# Altium project SPW-SPAI-ANODE-002D-SCH-FM.PrjPcb (part 1 of 3)
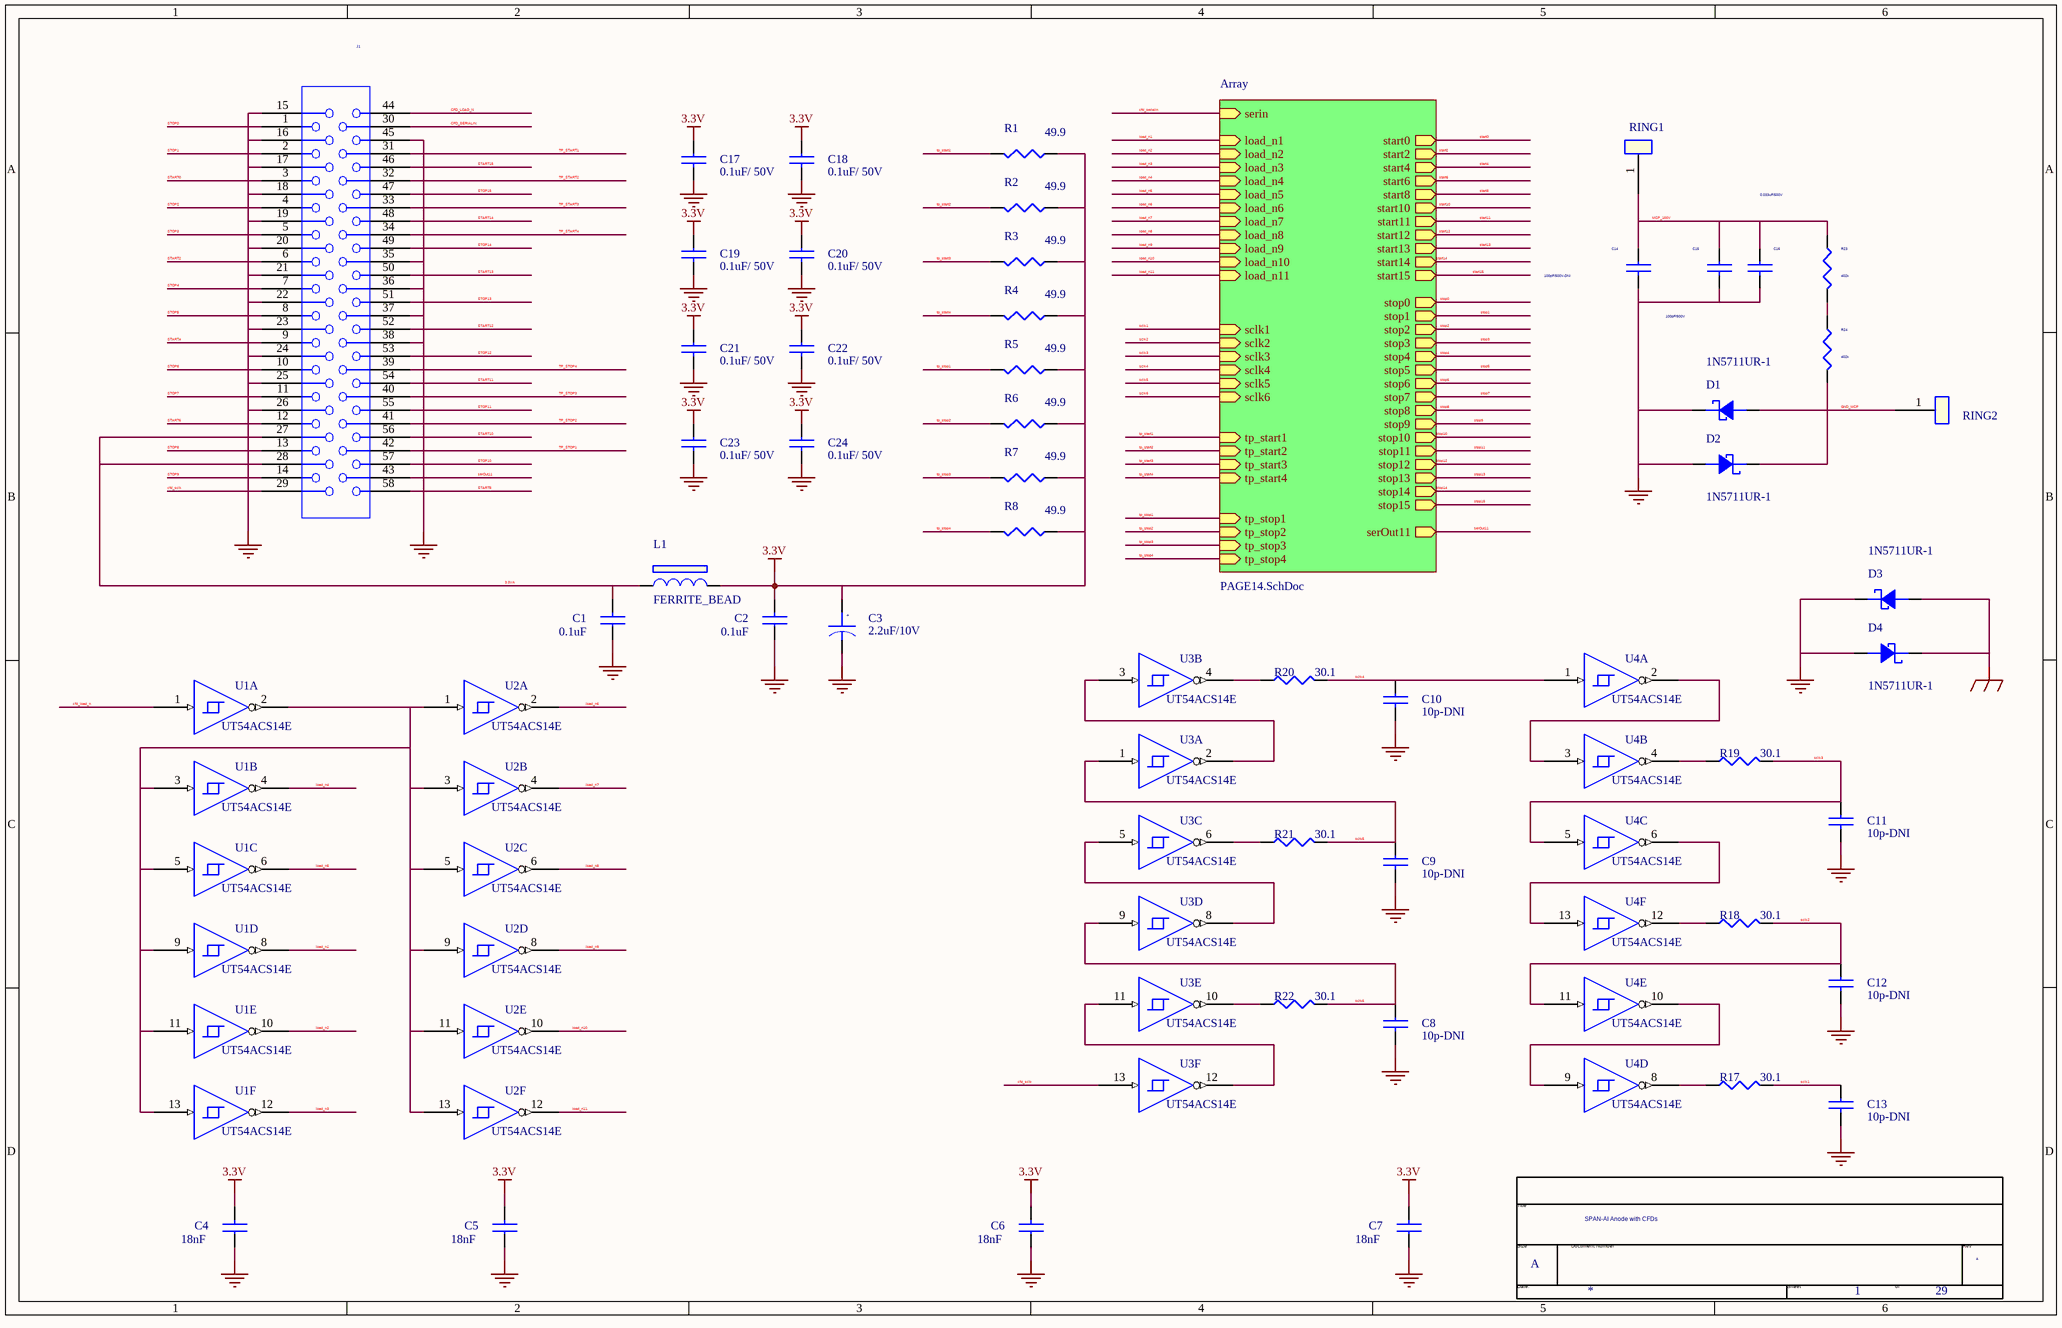
[diagram p0: PAGE1.SchDoc]
5 sheets, 648 parts. Net scope: hierarchical (ports join the sheet entries above them; power ports are global).
Sheets:
  PAGE1.SchDoc
    Array = PAGE14.SchDoc
      CFD17 = PAGE13.SchDoc
      CFD3 = PAGE11.SchDoc
      CFD15 = PAGE13.SchDoc
      CFD13 = PAGE13.SchDoc
      CFD11 = PAGE11.SchDoc
      CFD1 = PAGE11.SchDoc
      CFD9 = PAGE11.SchDoc
      CFD26 = PAGE12.SchDoc
      CFD24 = PAGE12.SchDoc
      CFD7 = PAGE11.SchDoc
      CFD22 = PAGE12.SchDoc
      CFD5 = PAGE11.SchDoc
      CFD20 = PAGE12.SchDoc
      CFD18 = PAGE12.SchDoc
      CFD16 = PAGE12.SchDoc
      CFD14 = PAGE12.SchDoc
      CFD12 = PAGE12.SchDoc
      CFD10 = PAGE11.SchDoc
      CFD2 = PAGE11.SchDoc
      CFD27 = PAGE12.SchDoc
      CFD25 = PAGE12.SchDoc
      CFD8 = PAGE11.SchDoc
      CFD23 = PAGE12.SchDoc
      CFD6 = PAGE11.SchDoc
      CFD21 = PAGE13.SchDoc
      CFD4 = PAGE11.SchDoc
      CFD19 = PAGE13.SchDoc

## Sheet PAGE1.SchDoc
size 386 x 246 mm

### Parts
(Parts that share a designator on the sheet are numbered #1, #2 ... from top to bottom, then left to right.)
*#1  Page Count: 29  Page Number: 1  Page Size: A  Title: SPAN-AI Anode with CFDs  (hidden comment: TitleBlock0)  (graphical)
C1  0.1uF  [1206]
C2  0.1uF  [1206]
C3  2.2uF/10V  [CAP-CWR069-B]
C4  18nF  [0805]
C5  18nF  [0805]
C6  18nF  [0805]
C7  18nF  [0805]
C8  10p-DNI  [0402]
C9  10p-DNI  [0402]
C10  10p-DNI  [0402]
C11  10p-DNI  [0402]
C12  10p-DNI  [0402]
C13  10p-DNI  [0402]
C14  100pF/500V-DNI  [1210MIL]
C15  100pF/500V  [1210MIL]
C16  0.033uF/500V  [1812MIL]
C17  0.1uF/ 50V  [1206]
C18  0.1uF/ 50V  [1206]
C19  0.1uF/ 50V  [1206]
C20  0.1uF/ 50V  [1206]
C21  0.1uF/ 50V  [1206]
C22  0.1uF/ 50V  [1206]
C23  0.1uF/ 50V  [1206]
C24  0.1uF/ 50V  [1206]
D1  1N5711UR-1  [DO-213AA]
D2  1N5711UR-1  [DO-213AA]
D3  1N5711UR-1  [DO-213AA]
D4  1N5711UR-1  [DO-213AA]
J1  CONNECTOR-HDLP-058M  [HDLP058M-SM]  (value not drawn)
L1  FERRITE_BEAD  [bead-300mil]
R1  49.9  [RES2512]
R2  49.9  [RES2512]
R3  49.9  [RES2512]
R4  49.9  [RES2512]
R5  49.9  [RES2512]
R6  49.9  [RES2512]
R7  49.9  [RES2512]
R8  49.9  [RES2512]
R17  30.1  [0402]
R18  30.1  [0402]
R19  30.1  [0402]
R20  30.1  [0402]
R21  30.1  [0402]
R22  30.1  [0402]
R23  402k  [1206MIL]
R24  402k  [1206MIL]
RING1  MCP_100V  [ANODE]  (value not drawn)
RING2  GND_MCP  [ANODE]  (value not drawn)
U1  UT54ACS14E  [UT54ACS14E]  (parts A,B,C,D,E,F of 6)
U2  UT54ACS14E  [UT54ACS14E]  (parts A,B,C,D,E,F of 6)
U3  UT54ACS14E  [UT54ACS14E]  (parts A,B,C,D,E,F of 6)
U4  UT54ACS14E  [UT54ACS14E]  (parts A,B,C,D,E,F of 6)

### Sub-sheets
Array = PAGE14.SchDoc: stop10 (out), stop5 (out), stop11 (out), stop6 (out), stop12 (out), stop7 (out), start2 (out), stop13 (out), stop8 (out), stop14 (out), stop9 (out), start4 (out), stop15 (out), start6 (out), start8 (out), start10 (out), start11 (out), stop1 (out), stop2 (out), stop3 (out), stop4 (out), load_n6 (in), sclk3 (in), load_n7 (in), sclk4 (in), load_n8 (in), sclk5 (in), sclk6 (in), tp_stop1 (in), tp_stop2 (in), tp_stop3 (in), tp_stop4 (in), tp_start1 (in), tp_start2 (in), tp_start3 (in), tp_start4 (in), load_n1 (in), load_n2 (in), load_n3 (in), load_n4 (in), sclk1 (in), load_n5 (in), sclk2 (in), serin (in), serOut11 (out), load_n9 (in), load_n10 (in), load_n11 (in), start0 (out), stop0 (out), start12 (out), start13 (out), start14 (out), start15 (out)  | CFD13_R105_PartReference: R1305; CFD13_R104_PartReference: R1304; CFD13_D1301_PartReference: D1301; CFD13_R1307_PartReference: R1307; CFD13_DL101_PartReference: DL1301; CFD13_C104_PartReference: C1304; CFD13_R108_PartReference: R108; CFD13_C102_PartReference: C1302; CFD13_R102_PartReference: R1302; CFD13_R101_PartReference: R1301; CFD13_R103_PartReference: R1303; CFD13_C105_PartReference: C1305; CFD13_U101_PartReference: U1301; CFD13_C101_PartReference: C1301; CFD13_C107_PartReference: C107; CFD13_R106_PartReference: R1306; CFD13_C106_PartReference: C1306; CFD13_C100_PartReference: C1300; CFD13_R1309_PartReference: R1309; CFD13_C103_PartReference: C1303; CFD13_TitleBlock_2_Page_Number: 17; CFD14_R1204_PartReference: R1404; CFD14_D1201_PartReference: D1401; CFD14_R1205_PartReference: R1405; CFD14_C1200_PartReference: C1400; CFD14_R1206_PartReference: R1406; CFD14_R108_PartReference: R1408; CFD14_U1201_PartReference: U1401; CFD14_R1202_PartReference: R1402; CFD14_R1207_PartReference: R1407; CFD14_C1204_PartReference: C1404; CFD14_R1203_PartReference: R1403; CFD14_C1201_PartReference: C1401; CFD14_C1206_PartReference: C1406; CFD14_C1207_PartReference: C1407; CFD14_C1205_PartReference: C1405; CFD14_DL1201_PartReference: DL1401; CFD14_R1201_PartReference: R1401; CFD14_R1209_PartReference: R1409; CFD14_C1203_PartReference: C1403; CFD14_C1202_PartReference: C1402; CFD14_TitleBlock_1_Page_Number: 27; CFD15_R105_PartReference: R1505; CFD15_R104_PartReference: R1504; CFD15_D1301_PartReference: D1501; CFD15_R1307_PartReference: R1507; CFD15_DL101_PartReference: DL1501; CFD15_C104_PartReference: C1504; CFD15_R108_PartReference: R1508; CFD15_C102_PartReference: C1502; CFD15_R102_PartReference: R1502; CFD15_R101_PartReference: R1501; CFD15_R103_PartReference: R1503; CFD15_C105_PartReference: C1505; CFD15_U101_PartReference: U1501; CFD15_C101_PartReference: C1501; CFD15_C107_PartReference: C1507; CFD15_R106_PartReference: R1506; CFD15_C106_PartReference: C1506; CFD15_C100_PartReference: C1500; CFD15_R1309_PartReference: R1509; CFD15_C103_PartReference: C1503; CFD15_TitleBlock_2_Page_Number: 6; CFD16_R1204_PartReference: R1604; CFD16_D1201_PartReference: D1601; CFD16_R1205_PartReference: R1605; CFD16_C1200_PartReference: C1600; CFD16_R1206_PartReference: R1606; CFD16_R108_PartReference: R1608; CFD16_U1201_PartReference: U1601; CFD16_R1202_PartReference: R1602; CFD16_R1207_PartReference: R1607; CFD16_C1204_PartReference: C1604; CFD16_R1203_PartReference: R1603; CFD16_C1201_PartReference: C1601; CFD16_C1206_PartReference: C1606; CFD16_C1207_PartReference: C1607; CFD16_C1205_PartReference: C1605; CFD16_DL1201_PartReference: DL1601; CFD16_R1201_PartReference: R1601; CFD16_R1209_PartReference: R1609; CFD16_C1203_PartReference: C1603; CFD16_C1202_PartReference: C1602; CFD16_TitleBlock_1_Page_Number: 14; CFD17_R105_PartReference: R1705; CFD17_R104_PartReference: R1704; CFD17_D1301_PartReference: D1701; CFD17_R1307_PartReference: R1707; CFD17_DL101_PartReference: DL1701; CFD17_C104_PartReference: C1704; CFD17_R108_PartReference: R1708; CFD17_C102_PartReference: C1702; CFD17_R102_PartReference: R1702; CFD17_R101_PartReference: R1701; CFD17_R103_PartReference: R1703; CFD17_C105_PartReference: C1705; CFD17_U101_PartReference: U1701; CFD17_C101_PartReference: C1701; CFD17_C107_PartReference: C1707; CFD17_R106_PartReference: R1706; CFD17_C106_PartReference: C1706; CFD17_C100_PartReference: C1700; CFD17_R1309_PartReference: R1709; CFD17_C103_PartReference: C1703; CFD17_TitleBlock_2_Page_Number: 3; CFD18_R1204_PartReference: R1804; CFD18_D1201_PartReference: D1801; CFD18_R1205_PartReference: R1805; CFD18_C1200_PartReference: C1800; CFD18_R1206_PartReference: R1806; CFD18_R108_PartReference: R1808; CFD18_U1201_PartReference: U1801; CFD18_R1202_PartReference: R1802; CFD18_R1207_PartReference: R1807; CFD18_C1204_PartReference: C1804; CFD18_R1203_PartReference: R1803; CFD18_C1201_PartReference: C1801; CFD18_C1206_PartReference: C1806; CFD18_C1207_PartReference: C1807; CFD18_C1205_PartReference: C1805; CFD18_DL1201_PartReference: DL1801; CFD18_R1201_PartReference: R1801; CFD18_R1209_PartReference: R1809; CFD18_C1203_PartReference: C1803; CFD18_C1202_PartReference: C1802; CFD18_TitleBlock_1_Page_Number: 13; CFD19_R105_PartReference: R1905; CFD19_R104_PartReference: R1904; CFD19_D1301_PartReference: D1901; CFD19_R1307_PartReference: R1907; CFD19_DL101_PartReference: DL1901; CFD19_C104_PartReference: C1904; CFD19_R108_PartReference: R1908; CFD19_C102_PartReference: C1902; CFD19_R102_PartReference: R1902; CFD19_R101_PartReference: R1901; CFD19_R103_PartReference: R1903; CFD19_C105_PartReference: C1905; CFD19_U101_PartReference: U1901; CFD19_C101_PartReference: C1901; CFD19_C107_PartReference: C1907; CFD19_R106_PartReference: R1906; CFD19_C106_PartReference: C1906; CFD19_C100_PartReference: C1900; CFD19_R1309_PartReference: R1909; CFD19_C103_PartReference: C1903; CFD19_TitleBlock_2_Page_Number: 15; CFD20_R1204_PartReference: R2004; CFD20_D1201_PartReference: D2001; CFD20_R1205_PartReference: R2005; CFD20_C1200_PartReference: C2000; CFD20_R1206_PartReference: R2006; CFD20_R108_PartReference: R2008; CFD20_U1201_PartReference: U2001; CFD20_R1202_PartReference: R2002; CFD20_R1207_PartReference: R2007; CFD20_C1204_PartReference: C2004; CFD20_R1203_PartReference: R2003; CFD20_C1201_PartReference: C2001; CFD20_C1206_PartReference: C2006; CFD20_C1207_PartReference: C2007; CFD20_C1205_PartReference: C2005; CFD20_DL1201_PartReference: DL2001; CFD20_R1201_PartReference: R2001; CFD20_R1209_PartReference: R2009; CFD20_C1203_PartReference: C2003; CFD20_C1202_PartReference: C2002; CFD20_TitleBlock_1_Page_Number: 24; CFD21_R105_PartReference: R2105; CFD21_R104_PartReference: R2104; CFD21_D1301_PartReference: D2101; CFD21_R1307_PartReference: R2107; CFD21_DL101_PartReference: DL2101; CFD21_C104_PartReference: C2104; CFD21_R108_PartReference: R2108; CFD21_C102_PartReference: C2102; CFD21_R102_PartReference: R2102; CFD21_R101_PartReference: R2101; CFD21_R103_PartReference: R2103; CFD21_C105_PartReference: C2105; CFD21_U101_PartReference: U2101; CFD21_C101_PartReference: C2101; CFD21_C107_PartReference: C2107; CFD21_R106_PartReference: R2106; CFD21_C106_PartReference: C2106; CFD21_C100_PartReference: C2100; CFD21_R1309_PartReference: R2109; CFD21_C103_PartReference: C2103; CFD21_TitleBlock_2_Page_Number: 22; CFD22_R1204_PartReference: R2204; CFD22_D1201_PartReference: D2201; CFD22_R1205_PartReference: R2205; CFD22_C1200_PartReference: C2200; CFD22_R1206_PartReference: R2206; CFD22_R108_PartReference: R2208; CFD22_U1201_PartReference: U2201; CFD22_R1202_PartReference: R2202; CFD22_R1207_PartReference: R2207; CFD22_C1204_PartReference: C2204; CFD22_R1203_PartReference: R2203; CFD22_C1201_PartReference: C2201; CFD22_C1206_PartReference: C2206; CFD22_C1207_PartReference: C2207; CFD22_C1205_PartReference: C2205; CFD22_DL1201_PartReference: DL2201; CFD22_R1201_PartReference: R2201; CFD22_R1209_PartReference: R2209; CFD22_C1203_PartReference: C2203; CFD22_C1202_PartReference: C2202; CFD22_TitleBlock_1_Page_Number: 19; CFD23_R1204_PartReference: R2304; CFD23_D1201_PartReference: D2301; CFD23_R1205_PartReference: R2305; CFD23_C1200_PartReference: C2300; CFD23_R1206_PartReference: R2306; CFD23_R108_PartReference: R2308; CFD23_U1201_PartReference: U2301; CFD23_R1202_PartReference: R2302; CFD23_R1207_PartReference: R2307; CFD23_C1204_PartReference: C2304; CFD23_R1203_PartReference: R2303; CFD23_C1201_PartReference: C2301; CFD23_C1206_PartReference: C2306; CFD23_C1207_PartReference: C2307; CFD23_C1205_PartReference: C2305; CFD23_DL1201_PartReference: DL2301; CFD23_R1201_PartReference: R2301; CFD23_R1209_PartReference: R2309; CFD23_C1203_PartReference: C2303; CFD23_C1202_PartReference: C2302; CFD23_TitleBlock_1_Page_Number: 20; CFD24_R1204_PartReference: R2404; CFD24_D1201_PartReference: D2401; CFD24_R1205_PartReference: R2405; CFD24_C1200_PartReference: C2400; CFD24_R1206_PartReference: R2406; CFD24_R108_PartReference: R2408; CFD24_U1201_PartReference: U2401; CFD24_R1202_PartReference: R2402; CFD24_R1207_PartReference: R2407; CFD24_C1204_PartReference: C2404; CFD24_R1203_PartReference: R2403; CFD24_C1201_PartReference: C2401; CFD24_C1206_PartReference: C2406; CFD24_C1207_PartReference: C2407; CFD24_C1205_PartReference: C2405; CFD24_DL1201_PartReference: DL2401; CFD24_R1201_PartReference: R2401; CFD24_R1209_PartReference: R2409; CFD24_C1203_PartReference: C2403; CFD24_C1202_PartReference: C2402; CFD24_TitleBlock_1_Page_Number: 26; CFD25_R1204_PartReference: R2504; CFD25_D1201_PartReference: D2501; CFD25_R1205_PartReference: R2505; CFD25_C1200_PartReference: C2500; CFD25_R1206_PartReference: R2506; CFD25_R108_PartReference: R2508; CFD25_U1201_PartReference: U2501; CFD25_R1202_PartReference: R2502; CFD25_R1207_PartReference: R2507; CFD25_C1204_PartReference: C2504; CFD25_R1203_PartReference: R2503; CFD25_C1201_PartReference: C2501; CFD25_C1206_PartReference: C2506; CFD25_C1207_PartReference: C2507; CFD25_C1205_PartReference: C2505; CFD25_DL1201_PartReference: DL2501; CFD25_R1201_PartReference: R2501; CFD25_R1209_PartReference: R2509; CFD25_C1203_PartReference: C2503; CFD25_C1202_PartReference: C2502; CFD25_TitleBlock_1_Page_Number: 11; CFD26_R1204_PartReference: R2604; CFD26_D1201_PartReference: D2601; CFD26_R1205_PartReference: R2605; CFD26_C1200_PartReference: C2600; CFD26_R1206_PartReference: R2606; CFD26_R108_PartReference: R2608; CFD26_U1201_PartReference: U2601; CFD26_R1202_PartReference: R2602; CFD26_R1207_PartReference: R2607; CFD26_C1204_PartReference: C2604; CFD26_R1203_PartReference: R2603; CFD26_C1201_PartReference: C2601; CFD26_C1206_PartReference: C2606; CFD26_C1207_PartReference: C2607; CFD26_C1205_PartReference: C2605; CFD26_DL1201_PartReference: DL2601; CFD26_R1201_PartReference: R2601; CFD26_R1209_PartReference: R2609; CFD26_C1203_PartReference: C2603; CFD26_C1202_PartReference: C2602; CFD26_TitleBlock_1_Page_Number: 9; CFD27_R1204_PartReference: R2704; CFD27_D1201_PartReference: D2701; CFD27_R1205_PartReference: R2705; CFD27_C1200_PartReference: C2700; CFD27_R1206_PartReference: R2706; CFD27_R108_PartReference: R2708; CFD27_U1201_PartReference: U2701; CFD27_R1202_PartReference: R2702; CFD27_R1207_PartReference: R2707; CFD27_C1204_PartReference: C2704; CFD27_R1203_PartReference: R2703; CFD27_C1201_PartReference: C2701; CFD27_C1206_PartReference: C2706; CFD27_C1207_PartReference: C2707; CFD27_C1205_PartReference: C2705; CFD27_DL1201_PartReference: DL2701; CFD27_R1201_PartReference: R2701; CFD27_R1209_PartReference: R2709; CFD27_C1203_PartReference: C2703; CFD27_C1202_PartReference: C2702; CFD27_TitleBlock_1_Page_Number: 5; CFD2_D101_PartReference: D201; CFD2_R107_PartReference: R207; CFD2_R105_PartReference: R205; CFD2_R104_PartReference: R204; CFD2_DL101_PartReference: DL201; CFD2_C104_PartReference: C204; CFD2_R108_PartReference: R208; CFD2_C102_PartReference: C202; CFD2_R109_PartReference: R209; CFD2_R102_PartReference: R202; CFD2_R101_PartReference: R201; CFD2_R103_PartReference: R203; CFD2_C105_PartReference: C205; CFD2_U101_PartReference: U201; CFD2_C101_PartReference: C201; CFD2_C107_PartReference: C207; CFD2_R106_PartReference: R206; CFD2_C106_PartReference: C206; CFD2_C100_PartReference: C200; CFD2_C103_PartReference: C203; CFD2_TitleBlock_2_Page_Number: 25; CFD1_D101_PartReference: D101; CFD1_R107_PartReference: R107; CFD1_R105_PartReference: R105; CFD1_R104_PartReference: R104; CFD1_DL101_PartReference: DL101; CFD1_C104_PartReference: C104; CFD1_R108_PartReference: R108; CFD1_C102_PartReference: C102; CFD1_R109_PartReference: R109; CFD1_R102_PartReference: R102; CFD1_R101_PartReference: R101; CFD1_R103_PartReference: R103; CFD1_C105_PartReference: C105; CFD1_U101_PartReference: U101; CFD1_C101_PartReference: C101; CFD1_C107_PartReference: C107; CFD1_R106_PartReference: R106; CFD1_C106_PartReference: C106; CFD1_C100_PartReference: C100; CFD1_C103_PartReference: C103; CFD1_TitleBlock_2_Page_Number: 12; CFD3_D101_PartReference: D301; CFD3_R107_PartReference: R307; CFD3_R105_PartReference: R305; CFD3_R104_PartReference: R304; CFD3_DL101_PartReference: DL301; CFD3_C104_PartReference: C304; CFD3_R108_PartReference: R308; CFD3_C102_PartReference: C302; CFD3_R109_PartReference: R309; CFD3_R102_PartReference: R302; CFD3_R101_PartReference: R301; CFD3_R103_PartReference: R303; CFD3_C105_PartReference: C305; CFD3_U101_PartReference: U301; CFD3_C101_PartReference: C301; CFD3_C107_PartReference: C307; CFD3_R106_PartReference: R306; CFD3_C106_PartReference: C306; CFD3_C100_PartReference: C300; CFD3_C103_PartReference: C303; CFD3_TitleBlock_2_Page_Number: 16; CFD4_D101_PartReference: D401; CFD4_R107_PartReference: R407; CFD4_R105_PartReference: R405; CFD4_R104_PartReference: R404; CFD4_DL101_PartReference: DL401; CFD4_C104_PartReference: C404; CFD4_R108_PartReference: R408; CFD4_C102_PartReference: C402; CFD4_R109_PartReference: R409; CFD4_R102_PartReference: R402; CFD4_R101_PartReference: R401; CFD4_R103_PartReference: R403; CFD4_C105_PartReference: C405; CFD4_U101_PartReference: U401; CFD4_C101_PartReference: C401; CFD4_C107_PartReference: C407; CFD4_R106_PartReference: R406; CFD4_C106_PartReference: C406; CFD4_C100_PartReference: C400; CFD4_C103_PartReference: C403; CFD4_TitleBlock_2_Page_Number: 23; CFD5_D101_PartReference: D501; CFD5_R107_PartReference: R507; CFD5_R105_PartReference: R505; CFD5_R104_PartReference: R504; CFD5_DL101_PartReference: DL501; CFD5_C104_PartReference: C504; CFD5_R108_PartReference: R508; CFD5_C102_PartReference: C502; CFD5_R109_PartReference: R509; CFD5_R102_PartReference: R502; CFD5_R101_PartReference: R501; CFD5_R103_PartReference: R503; CFD5_C105_PartReference: C505; CFD5_U101_PartReference: U501; CFD5_C101_PartReference: C501; CFD5_C107_PartReference: C507; CFD5_R106_PartReference: R506; CFD5_C106_PartReference: C506; CFD5_C100_PartReference: C500; CFD5_C103_PartReference: C503; CFD5_TitleBlock_2_Page_Number: 10; CFD6_D101_PartReference: D601; CFD6_R107_PartReference: R607; CFD6_R105_PartReference: R605; CFD6_R104_PartReference: R604; CFD6_DL101_PartReference: DL601; CFD6_C104_PartReference: C604; CFD6_R108_PartReference: R608; CFD6_C102_PartReference: C602; CFD6_R109_PartReference: R609; CFD6_R102_PartReference: R602; CFD6_R101_PartReference: R601; CFD6_R103_PartReference: R603; CFD6_C105_PartReference: C605; CFD6_U101_PartReference: U601; CFD6_C101_PartReference: C601; CFD6_C107_PartReference: C607; CFD6_R106_PartReference: R606; CFD6_C106_PartReference: C606; CFD6_C100_PartReference: C600; CFD6_C103_PartReference: C603; CFD6_TitleBlock_2_Page_Number: 21; CFD7_D101_PartReference: D701; CFD7_R107_PartReference: R707; CFD7_R105_PartReference: R705; CFD7_R104_PartReference: R704; CFD7_DL101_PartReference: DL701; CFD7_C104_PartReference: C704; CFD7_R108_PartReference: R708; CFD7_C102_PartReference: C702; CFD7_R109_PartReference: R709; CFD7_R102_PartReference: R702; CFD7_R101_PartReference: R701; CFD7_R103_PartReference: R703; CFD7_C105_PartReference: C705; CFD7_U101_PartReference: U701; CFD7_C101_PartReference: C701; CFD7_C107_PartReference: C707; CFD7_R106_PartReference: R706; CFD7_C106_PartReference: C706; CFD7_C100_PartReference: C700; CFD7_C103_PartReference: C703; CFD7_TitleBlock_2_Page_Number: 18; CFD8_D101_PartReference: D801; CFD8_R107_PartReference: R807; CFD8_R105_PartReference: R805; CFD8_R104_PartReference: R804; CFD8_DL101_PartReference: DL801; CFD8_C104_PartReference: C804; CFD8_R108_PartReference: R808; CFD8_C102_PartReference: C802; CFD8_R109_PartReference: R809; CFD8_R102_PartReference: R802; CFD8_R101_PartReference: R801; CFD8_R103_PartReference: R803; CFD8_C105_PartReference: C805; CFD8_U101_PartReference: U801; CFD8_C101_PartReference: C801; CFD8_C107_PartReference: C807; CFD8_R106_PartReference: R806; CFD8_C106_PartReference: C806; CFD8_C100_PartReference: C800; CFD8_C103_PartReference: C803; CFD8_TitleBlock_2_Page_Number: 28; CFD9_D101_PartReference: D901; CFD9_R107_PartReference: R907; CFD9_R105_PartReference: R905; CFD9_R104_PartReference: R904; CFD9_DL101_PartReference: DL901; CFD9_C104_PartReference: C904; CFD9_R108_PartReference: R908; CFD9_C102_PartReference: C902; CFD9_R109_PartReference: R909; CFD9_R102_PartReference: R902; CFD9_R101_PartReference: R901; CFD9_R103_PartReference: R903; CFD9_C105_PartReference: C905; CFD9_U101_PartReference: U901; CFD9_C101_PartReference: C901; CFD9_C107_PartReference: C907; CFD9_R106_PartReference: R906; CFD9_C106_PartReference: C906; CFD9_C100_PartReference: C900; CFD9_C103_PartReference: C903; CFD9_TitleBlock_2_Page_Number: 4; CFD10_D101_PartReference: D1001; CFD10_R107_PartReference: R1007; CFD10_R105_PartReference: R1005; CFD10_R104_PartReference: R1004; CFD10_DL101_PartReference: DL1001; CFD10_C104_PartReference: C1004; CFD10_R108_PartReference: R1008; CFD10_C102_PartReference: C1002; CFD10_R109_PartReference: R1009; CFD10_R102_PartReference: R1002; CFD10_R101_PartReference: R1001; CFD10_R103_PartReference: R1003; CFD10_C105_PartReference: C1005; CFD10_U101_PartReference: U1001; CFD10_C101_PartReference: C1001; CFD10_C107_PartReference: C1007; CFD10_R106_PartReference: R1006; CFD10_C106_PartReference: C1006; CFD10_C100_PartReference: C1000; CFD10_C103_PartReference: C1003; CFD10_TitleBlock_2_Page_Number: 2; CFD11_D101_PartReference: D1101; CFD11_R107_PartReference: R1107; CFD11_R105_PartReference: R1105; CFD11_R104_PartReference: R1104; CFD11_DL101_PartReference: DL1101; CFD11_C104_PartReference: C1104; CFD11_R108_PartReference: R1108; CFD11_C102_PartReference: C1102; CFD11_R109_PartReference: R1109; CFD11_R102_PartReference: R1102; CFD11_R101_PartReference: R1101; CFD11_R103_PartReference: R1103; CFD11_C105_PartReference: C1105; CFD11_U101_PartReference: U1101; CFD11_C101_PartReference: C1101; CFD11_C107_PartReference: C1107; CFD11_R106_PartReference: R1106; CFD11_C106_PartReference: C1106; CFD11_C100_PartReference: C1100; CFD11_C103_PartReference: C1103; CFD11_TitleBlock_2_Page_Number: 7; CFD12_R1204_PartReference: R1204; CFD12_D1201_PartReference: D1201; CFD12_R1205_PartReference: R1205; CFD12_C1200_PartReference: C1200; CFD12_R1206_PartReference: R1206; CFD12_R108_PartReference: R1208; CFD12_U1201_PartReference: U1201; CFD12_R1202_PartReference: R1202; CFD12_R1207_PartReference: R1207; CFD12_C1204_PartReference: C1204; CFD12_R1203_PartReference: R1203; CFD12_C1201_PartReference: C1201; CFD12_C1206_PartReference: C1206; CFD12_C1207_PartReference: C1207; CFD12_C1205_PartReference: C1205; CFD12_DL1201_PartReference: DL1201; CFD12_R1201_PartReference: R1201; CFD12_R1209_PartReference: R1209; CFD12_C1203_PartReference: C1203; CFD12_C1202_PartReference: C1202; CFD12_TitleBlock_1_Page_Number: 8; TitleBlock_Page_Number: 29

### Nets
3.3V: C2.2 C3.1 C4.2 C5.2 C6.2 C7.2 C17.1 C18.1 C19.1 C20.1 C21.1 C22.1 C23.1 C24.1 L1.2 R1.1 R2.1 R3.1 R4.1 R5.1 R6.1 R7.1 R8.1 U1.14(3.3V) U2.14(3.3V) U3.14(3.3V) U4.14(3.3V)
GND: C1.1 C2.1 C3.2 C4.1 C5.1 C6.1 C7.1 C8.2 C9.2 C10.2 C11.2 C12.2 C13.2 C14.2 C15.2 C16.2 C17.2 C18.2 C19.2 C20.2 C21.2 C22.2 C23.2 C24.2 D1.1(CATHODE) D2.2(ANODE) D3.1(CATHODE) D4.2(ANODE) J1.15 J1.16 J1.17 J1.18 J1.19 J1.20 J1.21 J1.22 J1.23 J1.24 J1.25 J1.26 J1.35 J1.36 J1.37 J1.38 J1.45 U1.7(GND) U2.7(GND) U3.7(GND) U4.7(GND)
GND_EARTH: D3.2(ANODE) D4.1(CATHODE)
3.3VA: C1.2 J1.27 J1.28 L1.1
CFD_LOAD_N: J1.44 U1.1(A)
cfd_sclk: J1.29 U3.13(A)
cfd_serialin: J1.30 ; sheet Array/serin
GND_MCP: D1.2(ANODE) D2.1(CATHODE) R24.2 RING2.1
load_n1: U1.8(Y) ; sheet Array/load_n1
load_n2: U1.10(Y) ; sheet Array/load_n2
load_n3: U1.12(Y) ; sheet Array/load_n3
load_n4: U1.4(Y) ; sheet Array/load_n4
load_n5: U1.6(Y) ; sheet Array/load_n5
load_n6: U2.2(Y) ; sheet Array/load_n6
load_n7: U2.4(Y) ; sheet Array/load_n7
load_n8: U2.6(Y) ; sheet Array/load_n8
load_n9: U2.8(Y) ; sheet Array/load_n9
load_n10: U2.10(Y) ; sheet Array/load_n10
load_n11: U2.12(Y) ; sheet Array/load_n11
MCP_100V: C14.1 C15.1 C16.1 R23.1 RING1.1
sclk1: C13.1 R17.2 ; sheet Array/sclk1
sclk2: C12.1 R18.2 U4.11(A) ; sheet Array/sclk2
sclk3: C11.1 R19.2 U4.5(A) ; sheet Array/sclk3
sclk4: C10.1 R20.2 U4.1(A) ; sheet Array/sclk4
sclk5: C9.1 R21.2 U3.1(A) ; sheet Array/sclk5
sclk6: C8.1 R22.2 U3.9(A) ; sheet Array/sclk6
serOut11: J1.43 ; sheet Array/serOut11
start0: J1.3 ; sheet Array/start0
start2: J1.6 ; sheet Array/start2
start4: J1.9 ; sheet Array/start4
start6: J1.12 ; sheet Array/start6
start8: J1.58 ; sheet Array/start8
start10: J1.56 ; sheet Array/start10
start11: J1.54 ; sheet Array/start11
start12: J1.52 ; sheet Array/start12
start13: J1.50 ; sheet Array/start13
start14: J1.48 ; sheet Array/start14
start15: J1.46 ; sheet Array/start15
stop0: J1.1 ; sheet Array/stop0
stop1: J1.2 ; sheet Array/stop1
stop2: J1.4 ; sheet Array/stop2
stop3: J1.5 ; sheet Array/stop3
stop4: J1.7 ; sheet Array/stop4
stop5: J1.8 ; sheet Array/stop5
stop6: J1.10 ; sheet Array/stop6
stop7: J1.11 ; sheet Array/stop7
stop8: J1.13 ; sheet Array/stop8
stop9: J1.14 ; sheet Array/stop9
stop10: J1.57 ; sheet Array/stop10
stop11: J1.55 ; sheet Array/stop11
stop12: J1.53 ; sheet Array/stop12
stop13: J1.51 ; sheet Array/stop13
stop14: J1.49 ; sheet Array/stop14
stop15: J1.47 ; sheet Array/stop15
tp_start1: J1.31 R1.2 ; sheet Array/tp_start1
tp_start2: J1.32 R2.2 ; sheet Array/tp_start2
tp_start3: J1.33 R3.2 ; sheet Array/tp_start3
tp_start4: J1.34 R4.2 ; sheet Array/tp_start4
tp_stop1: J1.42 R5.2 ; sheet Array/tp_stop1
tp_stop2: J1.41 R6.2 ; sheet Array/tp_stop2
tp_stop3: J1.40 R7.2 ; sheet Array/tp_stop3
tp_stop4: J1.39 R8.2 ; sheet Array/tp_stop4
NetR17_1: R17.1 U4.8(Y)
NetR18_1: R18.1 U4.12(Y)
NetR19_1: R19.1 U4.4(Y)
NetR20_1: R20.1 U3.4(Y)
NetR21_1: R21.1 U3.6(Y)
NetR22_1: R22.1 U3.10(Y)
NetR23_2: R23.2 R24.1
NetU1_2: U1.2(Y) U1.3(A) U1.5(A) U1.9(A) U1.11(A) U1.13(A) U2.1(A) U2.3(A) U2.5(A) U2.9(A) U2.11(A) U2.13(A)
NetU3_2: U3.2(Y) U3.3(A)
NetU3_5: U3.5(A) U3.8(Y)
NetU3_11: U3.11(A) U3.12(Y)
NetU4_2: U4.2(Y) U4.3(A)
NetU4_6: U4.6(Y) U4.13(A)
NetU4_9: U4.9(A) U4.10(Y)

### Notes on the sheet
- (in symbol CAP POL) +
- (in symbol TitleBlock0) Title; Size; Document Number; Rev; Date:; Sheet; of

### Library data of the parts
C1 C2 = CAP NP_Dup2: PartNumber: SR1206X7R104F2NT95#M123; PCB Footprint: 1206
C3 = CAP POL: PartNumber: CWR09FH225; PCB Footprint: CAP-CWR069-B
C4-C7 = CAP NP_Dup2: PartNumber: SR0805X7R183F2NT95#M123; PCB Footprint: 0805
C8-C13 = CAP NP_Dup2: PartNumber: SR0402NPO100F2NT95#M123; PCB Footprint: 0402
C14 C15 = CAP NP_Dup1: Source Part: CAP NP; Pin Numbers Visible: True; Pin Names Visible: False; EDIForiginalOrigin: (pt 0 0); EDIFviewName: NORMAL; Implementation Type: <none>; Desc: 200 V; Graphic: CAP NP; PCB Footprint: 1210MIL
C16 = CAP NP_Dup1: Source Part: CAP NP; PartNumber: SR1812X7R333K6NT9S; Pin Numbers Visible: True; Pin Names Visible: False; EDIForiginalOrigin: (pt 0 0); EDIFviewName: NORMAL; Implementation Type: <none>; Desc: 200 V; Graphic: CAP NP; PCB Footprint: 1812MIL
C17-C24 = CAP NP: PartNumber: G311P829AFN104K2N3; PCB Footprint: 1206
D1-D4 = DIODE SCHOTTKY_0: PartNumber: JANTXV1N5711UR-1; PCB Footprint: DO-213AA
J1 = CONNECTOR-HDLP-058M_2: OriginalSymbolOrigin: (0,0); PCB Footprint: HDLP058M-SM; PartNumber: HDLP058M-SM
L1 = INDUCTOR FERRITE: PCB Footprint: bead-300mil
R1-R8 = R_Dup1: PartNumber: M55342H09B49D9R; PCB Footprint: RES2512
R17-R22 = R_Dup1: PartNumber: M55342H11B30D1R; PCB Footprint: 0402
R23 R24 = R: Pin Numbers Visible: True; Pin Names Visible: False; EDIForiginalOrigin: (pt 0 0); EDIFviewName: NORMAL; Implementation Type: <none>; Desc: 200V / 0.25W; PCB Footprint: 1206MIL; Source Part: R; Graphic: R
RING1 RING2 = TEST POINT: PCB Footprint: ANODE
U1-U4 = 54AC14_0: PCB Footprint: UT54ACS14E; PartNumber: UT54ACS14E
*#1 = TitleBlock0: RevCode: A; Page Create Date: March  8, 1995; Page Modify Date: *; Page_Number: =TitleBlock_Page_Number